# EAGLE schematic eurorack-midi-controller (EAGLE 9.1.2)
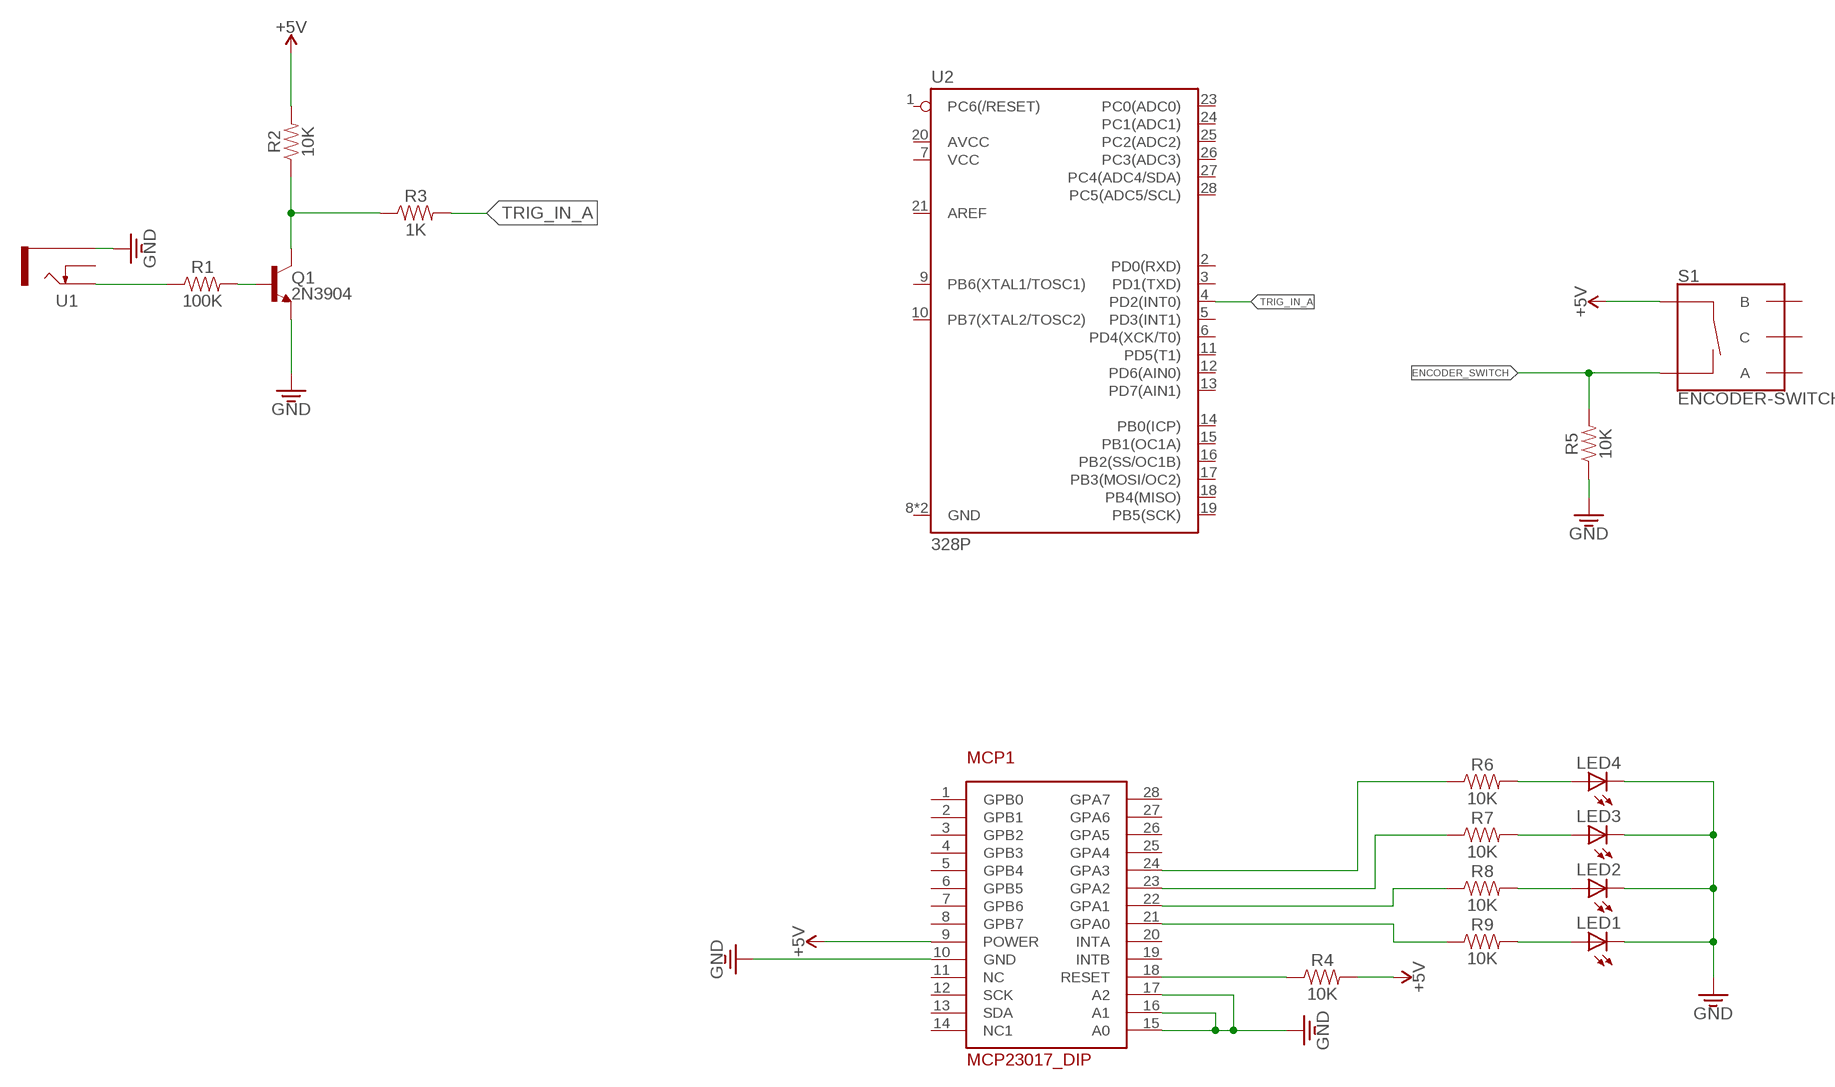
[diagram p0: schematic, sheet 1]

## Parts
LED1  LED3MM  [LED3MM]
LED2  LED3MM  [LED3MM]
LED3  LED3MM  [LED3MM]
LED4  LED3MM  [LED3MM]
MCP1  MCP23017_DIP  [DIP28]
Q1  2N3904  TRANS_NPN-2N3904  [TO-92]
R1  100K  RESISTOR_HORZ  [HORIZONTAL_RESISTOR]
R2  10K  RESISTOR_HORZ  [HORIZONTAL_RESISTOR]
R3  1K  RESISTOR_HORZ  [HORIZONTAL_RESISTOR]
R4  10K  RESISTOR_HORZ  [HORIZONTAL_RESISTOR]
R5  10K  RESISTOR_HORZ  [HORIZONTAL_RESISTOR]
R6  10K  RESISTOR_HORZ  [HORIZONTAL_RESISTOR]
R7  10K  RESISTOR_HORZ  [HORIZONTAL_RESISTOR]
R8  10K  RESISTOR_HORZ  [HORIZONTAL_RESISTOR]
R9  10K  RESISTOR_HORZ  [HORIZONTAL_RESISTOR]
S1  ENCODER-SWITCH  [ROTARY_ENC_PLAIN]
U1  THONKICONNNEW  [WQP-PJ301M-12_JACK]
U2  328P  ATMEGA328P_PDIP  [DIP28]

## Nets
3.3V: LED1.K(C) LED2.K(C) LED3.K(C) LED4.K(C) MCP1.10(GND) MCP1.15(A0) MCP1.16(A1) MCP1.17(A2) Q1.1(E) R5.1 U1.P$3_SLEEVE(SLEEVE) ; supply symbol labelled GND
5V: MCP1.9(POWER) R2.2 R4.2 S1.SW+ ; supply symbol labelled +5V
ENCODER_SWITCH: R5.2 S1.SW-
N$1: R1.1 U1.P$1_TIP(TIP)
N$2: Q1.2(B) R1.2
N$3: Q1.3(C) R2.1 R3.1
N$4: MCP1.21(GPA0) R9.1
N$5: LED1.A R9.2
N$6: MCP1.18(RESET) R4.1
N$7: MCP1.22(GPA1) R8.1
N$8: MCP1.23(GPA2) R7.1
N$9: MCP1.24(GPA3) R6.1
N$10: LED4.A R6.2
N$11: LED3.A R7.2
N$12: LED2.A R8.2
TRIG_IN_A: R3.2 U2.4(PD2(INT0))
Unconnected: MCP1.1(GPB0) MCP1.2(GPB1) MCP1.3(GPB2) MCP1.4(GPB3) MCP1.5(GPB4) MCP1.6(GPB5) MCP1.7(GPB6) MCP1.8(GPB7) MCP1.11(NC) MCP1.12(SCK) MCP1.13(SDA) MCP1.14(NC1) MCP1.19(INTB) MCP1.20(INTA) MCP1.25(GPA4) MCP1.26(GPA5) MCP1.27(GPA6) MCP1.28(GPA7) S1.A S1.B S1.C U1.P$2_SWITCH(SWITCH) U2.1(PC6(/RESET)) U2.2(PD0(RXD)) U2.3(PD1(TXD)) U2.5(PD3(INT1)) U2.6(PD4(XCK/T0)) U2.7(VCC) U2.8(GND) U2.9(PB6(XTAL1/TOSC1)) U2.10(PB7(XTAL2/TOSC2)) U2.11(PD5(T1)) U2.12(PD6(AIN0)) U2.13(PD7(AIN1)) U2.14(PB0(ICP)) U2.15(PB1(OC1A)) U2.16(PB2(SS/OC1B)) U2.17(PB3(MOSI/OC2)) U2.18(PB4(MISO)) U2.19(PB5(SCK)) U2.20(AVCC) U2.21(AREF) U2.22(GND) U2.23(PC0(ADC0)) U2.24(PC1(ADC1)) U2.25(PC2(ADC2)) U2.26(PC3(ADC3)) U2.27(PC4(ADC4/SDA)) U2.28(PC5(ADC5/SCL))

## Library data of the parts
LED1-LED4 = led:LED: LED OSRAM: - CHIPLED LG R971, LG N971, LY N971, LG Q971, LY Q971, LO R971, LY R971 LH N974, LH R974 LS Q976, LO Q976, LY Q976 LO Q996 - Hyper CHIPLED LW Q18S LB Q993, LB Q99A, LB R99A - SideLED LS A670, LO A670, LY A670, LG A670, LP A670 LB A673, LV A673, LT A673, LW A673 LH A674 LY A675 LS A676, LA A676, LO A676, LY A676, LW A676 LS A679, LY A679, LG A679 - Hyper Micro SIDELED® LS Y876, LA Y876, LO Y876, LY Y876 LT Y87S - SmartLED LW L88C, LW L88S LB L89C, LB L89S, LG L890 LS L89K, LO L89K, LY L89K LS L896, LA L896, LO L896, LY L896 - TOPLED LS T670, LO T670, LY T670, LG T670, LP T670 LSG T670, LSP T670, LSY T670, LOP T670, LYG T670 LG T671, LOG T671, LSG T671 LB T673, LV T673, LT T673, LW T673 LH T674 LS T676, LA T676, LO T676, LY T676, LB T676, LH T676, LSB T676, LW T676 LB T67C, LV T67C, LT T67C, LS T67K, LO T67K, LY T67K, LW E67C LS E67B, LA E67B, LO E67B, LY E67B, LB E67C, LV E67C, LT E67C LW T67C LS T679, LY T679, LG T679 LS T770, LO T770, LY T770, LG T770, LP T770 LB T773, LV T773, LT T773, LW T773 LH T774 LS E675, LA E675, LY E675, LS T675 LS T776, LA T776, LO T776, LY T776, LB T776 LHGB T686 LT T68C, LB T68C - Hyper Mini TOPLED® LB M676 - Mini TOPLED Santana® LG M470 LS M47K, LO M47K, LY M47K Source: http://www.osram.convergy.de LUXEON: - LUMILED® LXK2-PW12-R00, LXK2-PW12-S00, LXK2-PW14-U00, LXK2-PW14-V00 LXK2-PM12-R00, LXK2-PM12-S00, LXK2-PM14-U00 LXK2-PE12-Q00, LXK2-PE12-R00, LXK2-PE12-S00, LXK2-PE14-T00, LXK2-PE14-U00 LXK2-PB12-K00, LXK2-PB12-L00, LXK2-PB12-M00, LXK2-PB14-N00, LXK2-PB14-P00, LXK2-PB14-Q00 LXK2-PR12-L00, LXK2-PR12-M00, LXK2-PR14-Q00, LXK2-PR14-R00 LXK2-PD12-Q00, LXK2-PD12-R00, LXK2-PD12-S00 LXK2-PH12-R00, LXK2-PH12-S00 LXK2-PL12-P00, LXK2-PL12-Q00, LXK2-PL12-R00 Source: www.luxeon.com KINGBRIGHT: KA-3528ASYC Source: www.kingbright.com
MCP1 = ESSY:MCP23017_DIP
Q1 = SparkFun-DiscreteSemi:TRANS_NPN: NPN transistor Current controlled devices typically used to amplify current or used as a switch. BC547 - COM-08928 <http://www.sparkfun.com/products/8928> (TO-92 45V 100mA) (1.Collector 2.Base 3.Emitter) 2N3904 - COM-00521 <http://www.sparkfun.com/products/521> (TO-92 40V 200mA) (1.Emitter 2.Base 3.Collector) P2N2222A - COM-12852 <http://www.sparkfun.com/products/12852> (TO-92 40V 600mA) (1.Collector 2.Base 3.Emitter); PROD_ID: TRANS-08447; VALUE: 200mA/40V
R1-R9 = ESSY:RESISTOR_HORZ
S1 = SparkFun-Switches:ENCODER-SWITCH: Rotary Encoder w/ Select Switch Encoders rotate similarly to potentiometers, but they’re different from potentiometers in that an encoder has full rotation without limits. They output gray code so that you can tell how much and in which direction the encoder has been turned. This encoder includes a push-down select switch built into the shaft. SparkFun Products Rotary Encoder <https://www.sparkfun.com/products/9117> (COM-09117); SF_SKU: COM-09117
U1 = MusicThingModular:THONKICONN: 3.5mm socket for Eurorack modular synths
U2 = SparkFun-IC-Microcontroller:ATMEGA328P_PDIP: Atmel 328P Through hole ATMEGA328P uC used in the Arduino 32kb flash, 1k EEPROM, 2k SRAM Datasheet <http://www.sparkfun.com/datasheets/Components/SMD/ATMega328.pdf> SparkFun Products Storefront component: AVR 28 Pin 20MHz 32K 6A/D - ATMega328P <https://www.sparkfun.com/products/9061> (COM-09061) SparkFun Simon Says - Through-Hole Soldering Kit <https://www.sparkfun.com/products/10547> (KIT-10547) SparkFun Learn to Solder - Simon Says <https://www.sparkfun.com/products/13708> (KIT-13708) SparkFun BigTime Watch Kit <https://www.sparkfun.com/products/11734> (KIT-11734) SparkFun ClockIt <https://www.sparkfun.com/products/10930> (KIT-10930) SparkFun Serial Enabled LCD Kit <https://www.sparkfun.com/products/10097> (LCD-10097) SparkFun Simon Tilts - Through Hole Soldering Kit <https://www.sparkfun.com/products/12634> (KIT-12634) SparkFun Frequency Counter Kit <https://www.sparkfun.com/products/10140> (KIT-10140) FabFM Radio Kit <https://www.sparkfun.com/products/11043> (KIT-11043) SparkFun Binary Blaster Kit <https://www.sparkfun.com/products/12037> (KIT-12037) SparkFun Metro-Gnome <https://www.sparkfun.com/products/9236> (KIT-09236) ATmega328 with Arduino Optiboot (Uno) <https://www.sparkfun.com/products/10524> (DEV-10524); PROD_ID: IC-09136